# EAGLE design ATM90E36_Breakout (EAGLE 7.4.0)
CNAME: ATM90E36_3P4W; CREVISION: 1.0; DESIGNER: Tisham Dhar
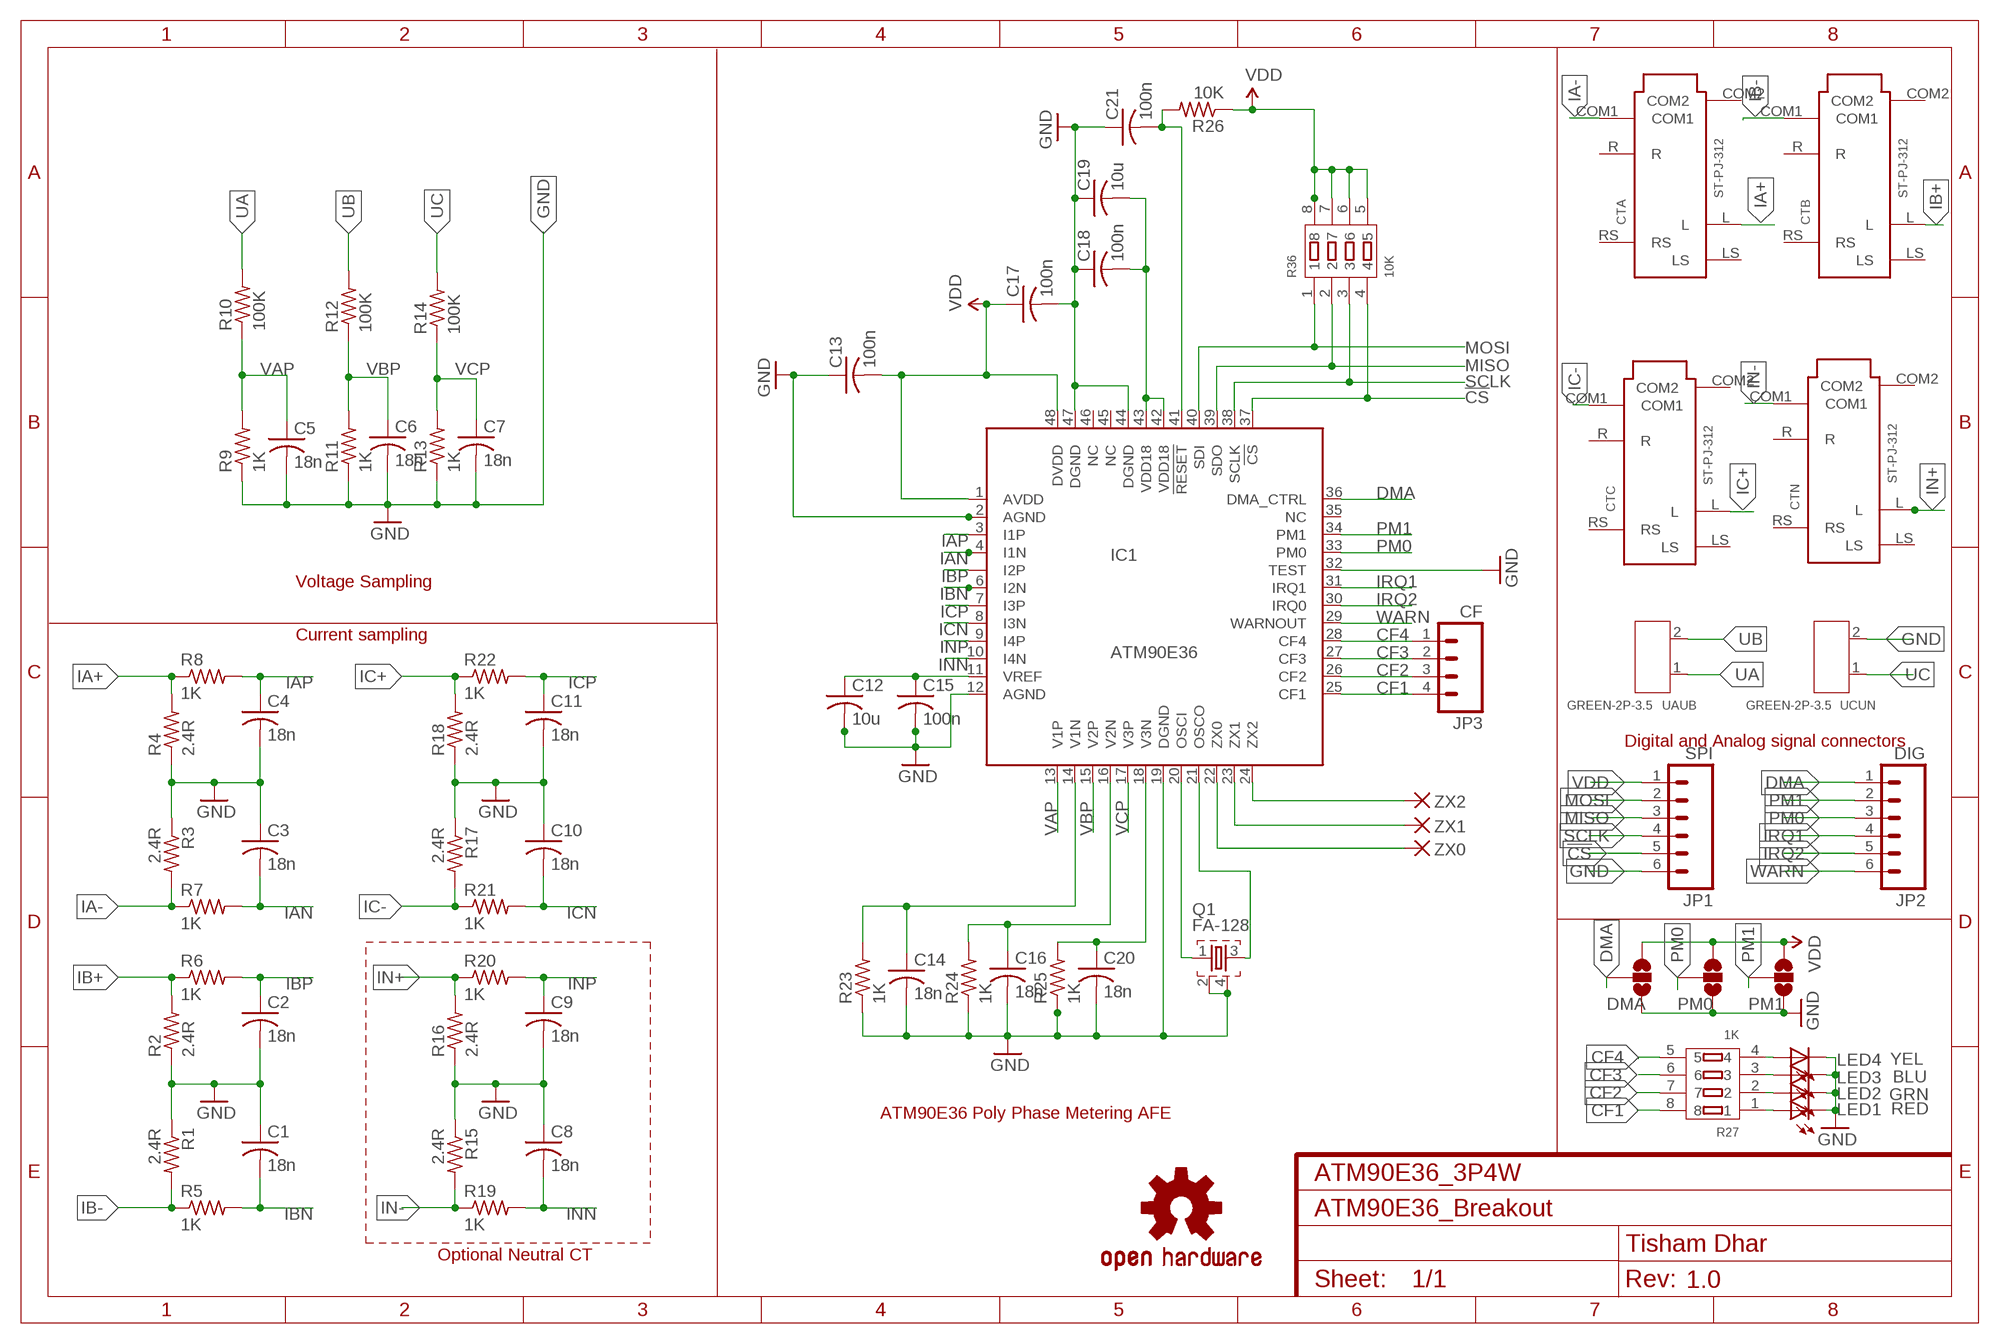
[diagram p0: schematic, sheet 1]

## Parts
C1  18n  C-USC0603  [C0603]
C2  18n  C-USC0603  [C0603]
C3  18n  C-USC0603  [C0603]
C4  18n  C-USC0603  [C0603]
C5  18n  C-USC0603  [C0603]
C6  18n  C-USC0603  [C0603]
C7  18n  C-USC0603  [C0603]
C8  18n  C-USC0603  [C0603]
C9  18n  C-USC0603  [C0603]
C10  18n  C-USC0603  [C0603]
C11  18n  C-USC0603  [C0603]
C12  10u  C-USC0805  [C0805]
C13  100n  C-USC0603  [C0603]
C14  18n  C-USC0603  [C0603]
C15  100n  C-USC0603  [C0603]
C16  18n  C-USC0603  [C0603]
C17  100n  C-USC0603  [C0603]
C18  100n  C-USC0603  [C0603]
C19  10u  C-USC0805  [C0805]
C20  18n  C-USC0603  [C0603]
C21  100n  C-USC0603  [C0603]
CTA  ST-PJ-312  AUDIO-JACK-6P-SMD(ST-PJ-312)  [AUDIO6P-SMD-3.5-14.0X6.4X5.0MM]
CTB  ST-PJ-312  AUDIO-JACK-6P-SMD(ST-PJ-312)  [AUDIO6P-SMD-3.5-14.0X6.4X5.0MM]
CTC  ST-PJ-312  AUDIO-JACK-6P-SMD(ST-PJ-312)  [AUDIO6P-SMD-3.5-14.0X6.4X5.0MM]
CTN  ST-PJ-312  AUDIO-JACK-6P-SMD(ST-PJ-312)  [AUDIO6P-SMD-3.5-14.0X6.4X5.0MM]
DMA  JUMPER-PAD-3-NOFULL_BOX_SILK  [PAD-JUMPER-3-NO_YES_SILK_FULL_BOX]
IC1  ATM90E36  [TQFP48]
JP1  SPI  M06LOCK  [1X06_LOCK]
JP2  DIG  M06LOCK  [1X06_LOCK]
JP3  CF  M04LOCK  [1X04_LOCK]
LED1  RED  LEDCHIP-LED0603  [CHIP-LED0603]
LED2  GRN  LEDCHIP-LED0603  [CHIP-LED0603]
LED3  BLU  LEDCHIP-LED0603  [CHIP-LED0603]
LED4  YEL  LEDCHIP-LED0603  [CHIP-LED0603]
LOGO1  OSHW-LOGOM  [OSHW-LOGO-M]
PM0  JUMPER-PAD-3-NOFULL_BOX_SILK  [PAD-JUMPER-3-NO_YES_SILK_FULL_BOX]
PM1  JUMPER-PAD-3-NOFULL_BOX_SILK  [PAD-JUMPER-3-NO_YES_SILK_FULL_BOX]
Q1  FA-128  [FA-128]
R1  2.4R  R-US_R0603  [R0603]
R2  2.4R  R-US_R0603  [R0603]
R3  2.4R  R-US_R0603  [R0603]
R4  2.4R  R-US_R0603  [R0603]
R5  1K  R-US_R0603  [R0603]
R6  1K  R-US_R0603  [R0603]
R7  1K  R-US_R0603  [R0603]
R8  1K  R-US_R0603  [R0603]
R9  1K  R-US_R0603  [R0603]
R10  100K  R-US_R0603  [R0603]
R11  1K  R-US_R0603  [R0603]
R12  100K  R-US_R0603  [R0603]
R13  1K  R-US_R0603  [R0603]
R14  100K  R-US_R0603  [R0603]
R15  2.4R  R-US_R0603  [R0603]
R16  2.4R  R-US_R0603  [R0603]
R17  2.4R  R-US_R0603  [R0603]
R18  2.4R  R-US_R0603  [R0603]
R19  1K  R-US_R0603  [R0603]
R20  1K  R-US_R0603  [R0603]
R21  1K  R-US_R0603  [R0603]
R22  1K  R-US_R0603  [R0603]
R23  1K  R-US_R0603  [R0603]
R24  1K  R-US_R0603  [R0603]
R25  1K  R-US_R0603  [R0603]
R26  10K  R-US_R0603  [R0603]
R27  1K  SMD-RES-ARRAY-1K-4R(RA1206-8)  [RA1206-8]
R36  10K  SMD-RES-ARRAY-1K-4R(RA1206-8)  [RA1206-8]
UAUB  GREEN-2P-3.5  SCREW-TERMINAL-GREEN(2P-3.5)  [H2-3.5-7.0X7.0MM]
UCUN  GREEN-2P-3.5  SCREW-TERMINAL-GREEN(2P-3.5)  [H2-3.5-7.0X7.0MM]
ZX0  ZX0  SMD2  [SMD1,27-2,54]
ZX1  ZX1  SMD2  [SMD1,27-2,54]
ZX2  ZX0  SMD2  [SMD1,27-2,54]

## Nets
!CS: IC1.37(!CS) JP1.5 R36.4
CF1: IC1.25(CF1) JP3.4 R27.8
CF2: IC1.26(CF2) JP3.3 R27.7
CF3: IC1.27(CF3) JP3.2 R27.6
CF4: IC1.28(CF4) JP3.1 R27.5
DMA: DMA.2 IC1.36(DMA_CTRL) JP2.1
GND [pwr]: C1.1 C2.2 C3.1 C4.2 C5.2 C6.2 C7.2 C8.1 C9.2 C10.1 C11.2 C12.2 C13.1 C14.2 C15.2 C16.2 C17.2 C18.1 C19.1 C20.2 C21.1 DMA.3 IC1.2(AGND) IC1.12(AGND) IC1.19(DGND) IC1.32(TEST) IC1.44(DGND) IC1.47(DGND) JP1.6 LED1.C LED2.C LED3.C LED4.C PM0.3 PM1.3 Q1.2 Q1.4 R1.1 R2.1 R3.1 R4.1 R9.1 R11.1 R13.1 R15.1 R16.1 R17.1 R18.1 R23.1 R24.1 R25.1 UCUN.2
IA+ [analog]: CTA.L R4.2 R8.1
IA- [analog]: CTA.COM1 R3.2 R7.1
IAN [analog]: C3.2 IC1.4(I1N) R7.2
IAP [analog]: C4.1 IC1.3(I1P) R8.2
IB+ [analog]: CTB.L R2.2 R6.1
IB- [analog]: CTB.COM1 R1.2 R5.1
IBN [analog]: C1.2 IC1.6(I2N) R5.2
IBP [analog]: C2.1 IC1.5(I2P) R6.2
IC+ [analog]: CTC.L R18.2 R22.1
IC- [analog]: CTC.COM1 R17.2 R21.1
ICN [analog]: C10.2 IC1.8(I3N) R21.2
ICP [analog]: C11.1 IC1.7(I3P) R22.2
IN+ [analog]: CTN.L R16.2 R20.1
IN- [analog]: CTN.COM1 R15.2 R19.1
INN [analog]: C8.2 IC1.10(I4N) R19.2
INP [analog]: C9.1 IC1.9(I4P) R20.2
IRQ1: IC1.31(IRQ1) JP2.4
IRQ2: IC1.30(IRQ0) JP2.5
MISO: IC1.39(SDO) JP1.3 R36.2
MOSI: IC1.40(SDI) JP1.2 R36.1
N$1: C21.2 IC1.41(!RESET) R26.2
N$3: LED4.A R27.4
N$4: LED3.A R27.3
N$5: LED2.A R27.2
N$6: LED1.A R27.1
N$27 [analog]: C14.1 IC1.14(V1N) R23.2
N$28: IC1.20(OSCI) Q1.1
N$29 [analog]: C16.1 IC1.16(V2N) R24.2
N$30 [analog]: C20.1 IC1.18(V3N) R25.2
N$31: IC1.21(OSCO) Q1.3
N$40 [pwr]: C18.2 C19.2 IC1.42(VDD18) IC1.43(VDD18)
N$55: C12.1 C15.1 IC1.11(VREF)
PM0: IC1.33(PM0) JP2.3 PM0.2
PM1: IC1.34(PM1) JP2.2 PM1.2
SCLK: IC1.38(SCLK) JP1.4 R36.3
UA [analog]: R10.2 UAUB.1
UB [analog]: R12.2 UAUB.2
UC [analog]: R14.2 UCUN.1
VAP [analog]: C5.1 IC1.13(V1P) R9.2 R10.1
VBP [analog]: C6.1 IC1.15(V2P) R11.2 R12.1
VCP [analog]: C7.1 IC1.17(V3P) R13.2 R14.1
VDD [pwr]: C13.2 C17.1 DMA.1 IC1.1(AVDD) IC1.48(DVDD) JP1.1 PM0.1 PM1.1 R26.1 R36.5 R36.6 R36.7 R36.8
WARN: IC1.29(WARNOUT) JP2.6
ZX0: IC1.22(ZX0) ZX0.1(P)
ZX1: IC1.23(ZX1) ZX1.1(P)
ZX2: IC1.24(ZX2) ZX2.1(P)
Unconnected: CTA.COM2 CTA.LS CTA.R CTA.RS CTB.COM2 CTB.LS CTB.R CTB.RS CTC.COM2 CTC.LS CTC.R CTC.RS CTN.COM2 CTN.LS CTN.R CTN.RS IC1.35(NC) IC1.45(NC) IC1.46(NC)

## Notes on the sheet
- Voltage Sampling
- Current sampling
- Digital and Analog signal connectors
- ATM90E36 Poly Phase Metering AFE
- Optional Neutral CT

## Library data of the parts
C1-C21 = adafruit:C-US: CAPACITOR, American symbol
CTA CTB CTC CTN = Seeed-Connector -2016:AUDIO-JACK-6P-SMD(ST-PJ-312): 320040007; MPN: ST-PJ-312
DMA PM0 PM1 = SparkFun-Passives:JUMPER-PAD-3-NO
IC1 = ATM90E36:ATM90E36: ATMEL Poly-phase energy metering; OC_FARNELL: unknown; OC_NEWARK: unknown
JP1 JP2 = SparkFun-Connectors:M06: Header 6 Standard 6-pin 0.1" header. Use with straight break away headers (SKU : PRT-00116), right angle break away headers (PRT-00553), swiss pins (PRT-00743), machine pins (PRT-00117), and female headers (PRT-00115). Molex polarized connector foot print use with SKU : PRT-08094 with associated crimp pins and housings. NOTES ON THE VARIANTS LOCK and LOCK_LONGPADS... This footprint was designed to help hold the alignment of a through-hole component (i.e. 6-pin header) while soldering it into place. You may notice that each hole has been shifted either up or down by 0.005 of an inch from it's more standard position (which is a perfectly straight line). This slight alteration caused the pins (the squares in the middle) to touch the edges of the holes. Because they are alternating, it causes a "brace" to hold the component in place. 0.005 has proven to be the perfect amount of "off-center" position when using our standard breakaway headers. Although looks a little odd when you look at the bare footprint, once you have a header in there, the alteration is very hard to notice. Also,if you push a header all the way into place, it is covered up entirely on the bottom side. This idea of altering the position of holes to aid alignment will be further integrated into the Sparkfun Library for other footprints. It can help hold any component with 3 or more connection pins.
JP3 = SparkFun-Connectors:M04: Header 4 Standard 4-pin 0.1" header. Use with straight break away headers (SKU : PRT-00116), right angle break away headers (PRT-00553), swiss pins (PRT-00743), machine pins (PRT-00117), and female headers (PRT-00115). Molex polarized connector foot print use with SKU : PRT-08231 with associated crimp pins and housings. 1MM SMD Version SKU: PRT-10208
LED1-LED4 = adafruit:LED: LED OSRAM: - CHIPLED LG R971, LG N971, LY N971, LG Q971, LY Q971, LO R971, LY R971 LH N974, LH R974 LS Q976, LO Q976, LY Q976 LO Q996 - Hyper CHIPLED LW Q18S LB Q993, LB Q99A, LB R99A - SideLED LS A670, LO A670, LY A670, LG A670, LP A670 LB A673, LV A673, LT A673, LW A673 LH A674 LY A675 LS A676, LA A676, LO A676, LY A676, LW A676 LS A679, LY A679, LG A679 - Hyper Micro SIDELED® LS Y876, LA Y876, LO Y876, LY Y876 LT Y87S - SmartLED LW L88C, LW L88S LB L89C, LB L89S, LG L890 LS L89K, LO L89K, LY L89K LS L896, LA L896, LO L896, LY L896 - TOPLED LS T670, LO T670, LY T670, LG T670, LP T670 LSG T670, LSP T670, LSY T670, LOP T670, LYG T670 LG T671, LOG T671, LSG T671 LB T673, LV T673, LT T673, LW T673 LH T674 LS T676, LA T676, LO T676, LY T676, LB T676, LH T676, LSB T676, LW T676 LB T67C, LV T67C, LT T67C, LS T67K, LO T67K, LY T67K, LW E67C LS E67B, LA E67B, LO E67B, LY E67B, LB E67C, LV E67C, LT E67C LW T67C LS T679, LY T679, LG T679 LS T770, LO T770, LY T770, LG T770, LP T770 LB T773, LV T773, LT T773, LW T773 LH T774 LS E675, LA E675, LY E675, LS T675 LS T776, LA T776, LO T776, LY T776, LB T776 LHGB T686 LT T68C, LB T68C - Hyper Mini TOPLED® LB M676 - Mini TOPLED Santana® LG M470 LS M47K, LO M47K, LY M47K Source: http://www.osram.convergy.de/
LOGO1 = SparkFun-Aesthetics:OSHW-LOGO: Open Source Hardware Logo This logo indicates the piece of hardware it is found on incorporates a OSHW license and/or adheres to the definition of open source hardware found here: http://freedomdefined.org/OSHW
Q1 = crystal:FA-: MHz RANGE CRYSTAL UNIT Source: Epson Toyocom
R1-R26 = adafruit:R-US_: RESISTOR, American symbol
R27 = Seeed-Resistor-2016:SMD-RES-ARRAY-1K-4R(RA1206-8): 301030012; MPN: Chip-Array-Series-1%
R36 = Seeed-Resistor-2016:SMD-RES-ARRAY-1K-4R(RA1206-8): 301030012; MPN: Chip-Array-Series-1%; VALUE: 1K
UAUB UCUN = Seeed-Connector -2016:SCREW-TERMINAL-GREEN(2P-3.5): 320110028
ZX0 ZX1 ZX2 = wirepad:SMD2: SMD PAD

## Net classes
0 default: width 0.152 mm, drill 0.33 mm, clearance 0.152 mm
1 pwr: width 0.305 mm, drill 0.356 mm, clearance 0.152 mm
2 analog: width 0.305 mm, drill 0.33 mm, clearance 0.152 mm

## Board
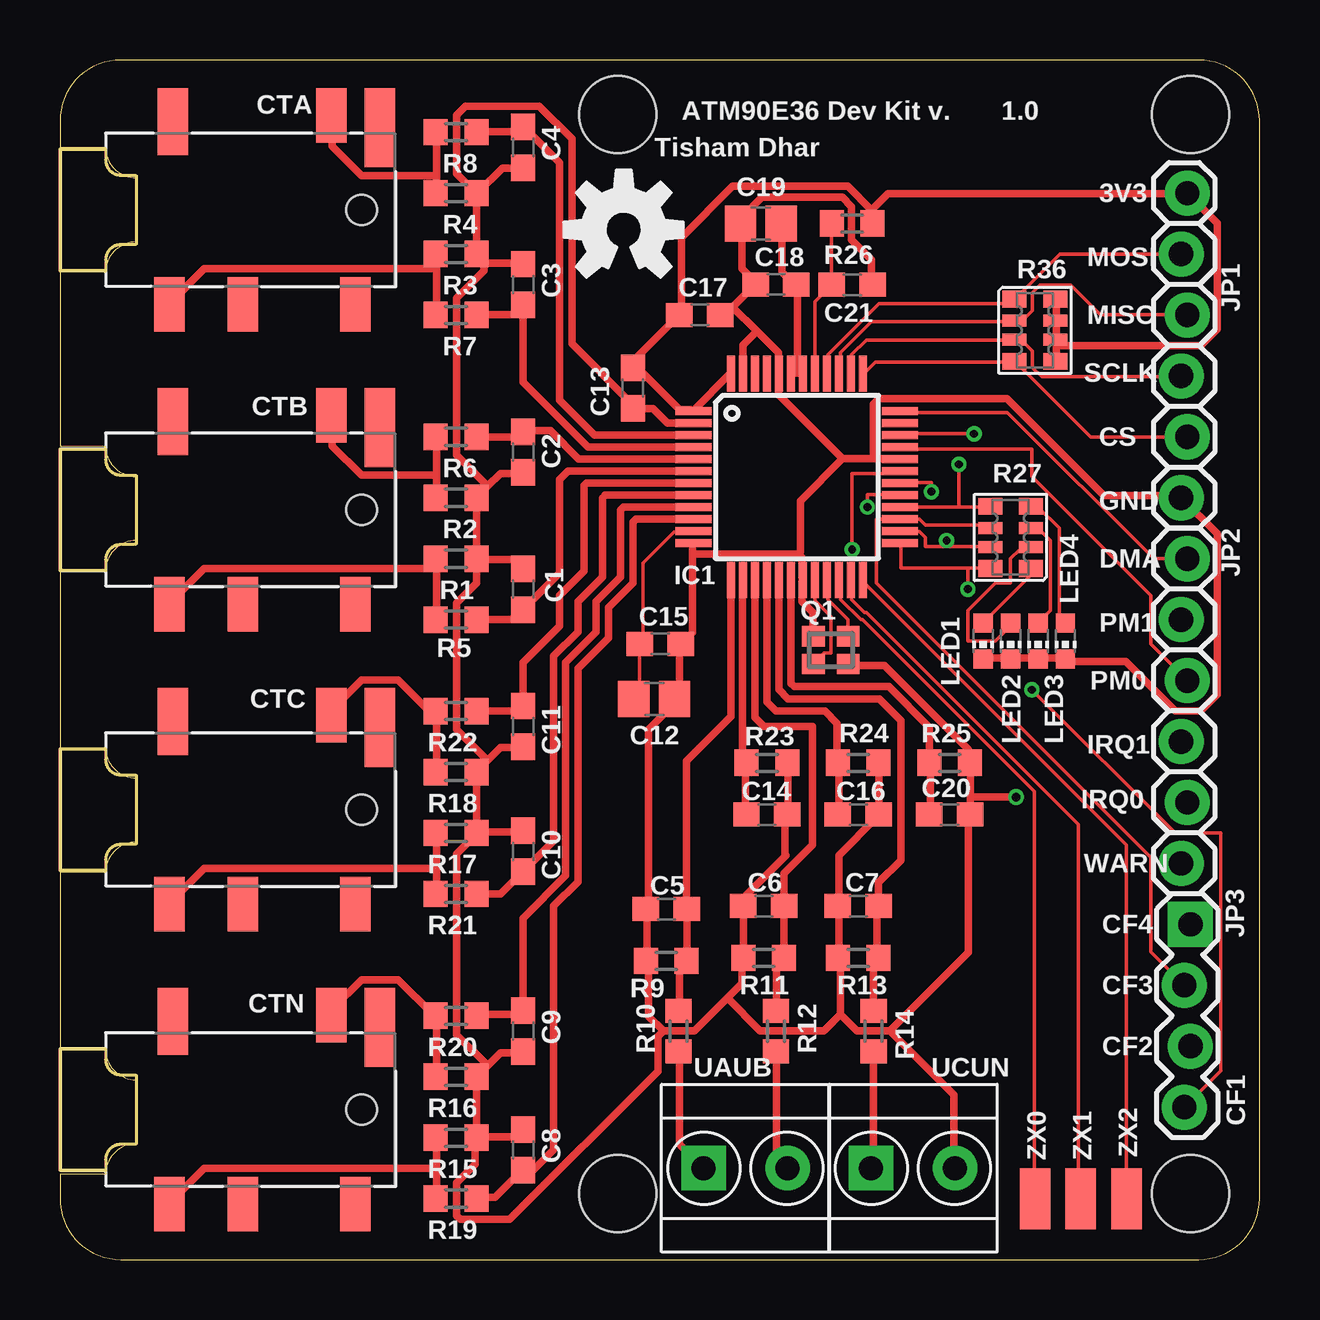
[diagram p1: board, top side]
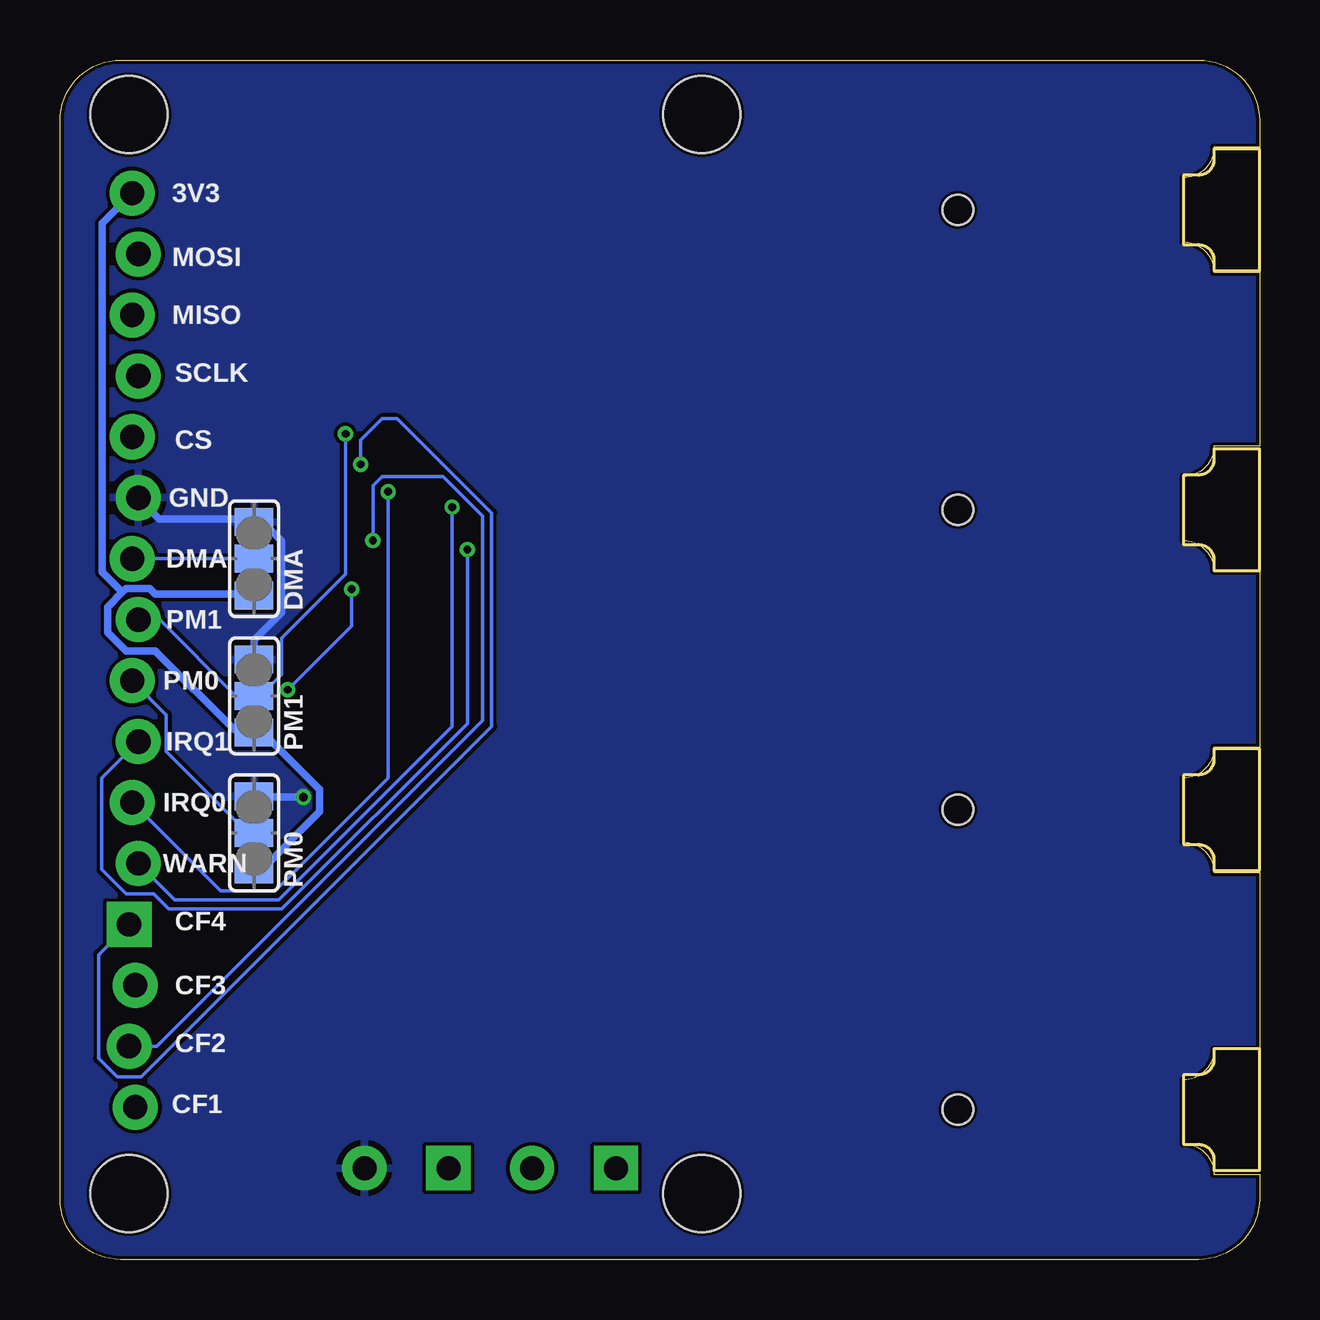
[diagram p2: board, bottom side, seen from below]

Size 50 x 50 mm. Coordinates in mm from the lower left corner, seen from the top.
Outline: 0,47.46 0,46.35 1.91,46.35 arc90 3.17,45.09 3.17,42.42 arc90 1.91,41.15 0,41.15 0,33.91 1.91,33.91 arc90 3.17,32.64 3.17,29.97 arc90 1.91,28.7 0,28.7 0,21.34 1.91,21.34 arc90 3.17,20.07 3.17,17.4 arc90 1.91,16.13 0,16.13 0,8.76 1.91,8.76 arc90 3.17,7.49 3.17,4.83 arc90 1.91,3.56 0,3.56 0,2.54 arc90 2.54,0 47.46,0 arc90 50,2.54 50,47.46 arc90 47.46,50 2.54,50 arc90 0,47.46
Copper layers (1*16): Top 0.035mm / dielectric 1.5mm / Bottom 0.035mm
Design rules "hackvana": minimum track width 6mil, minimum drill 0.3mm, track to track 6mil, track to pad 6mil, pad to pad 6mil, via to via 6mil, smd to smd 0mil, copper to edge 6mil, drill to drill 6mil, minimum pad ring 10mil, minimum via ring 6mil, stop-mask expansion 2mil, vias tented up to drill 100mil, thermal gap 10mil
Holes 3.2 mm at 23.25,47.73 47.12,47.73 47.12,2.75 23.25,2.75

### Footprints (pad centres in the part's own frame; a part is rotated, then mirrored left to right if it is on the bottom)
C0603 = smd 1.1 x 1: 1 -0.85,0; 2 0.85,0
C0805 = smd 1.3 x 1.5: 1 -0.85,0; 2 0.85,0
AUDIO6P-SMD-3.5-14.0X6.4X5.0MM = smd 1.27 x 2.286: COM1 -4.572,3.937; L -11.303,-3.937; R -7.62,3.937; RS -12.319,3.937 | smd 1.27 x 2.794: COM2 -4.699,-3.683 | smd 1.27 x 3.302: LS -13.335,-3.429 | hole 1.27: -12.573,0
PAD-JUMPER-3-NO_YES_SILK_FULL_BOX = smd 1.168 x 1.6: 1 -1.524,0; 2 0,0; 3 1.524,0
TQFP48 = smd 1.499 x 0.33: 1 -4.3,2.75; 2 -4.3,2.25; 3 -4.3,1.75; 4 -4.3,1.25; 5 -4.3,0.75; 6 -4.3,0.25; 7 -4.3,-0.25; 8 -4.3,-0.75; 9 -4.3,-1.25; 10 -4.3,-1.75; 11 -4.3,-2.25; 12 -4.3,-2.75; 25 4.3,-2.75; 26 4.3,-2.25; 27 4.3,-1.75; 28 4.3,-1.25; 29 4.3,-0.75; 30 4.3,-0.25; 31 4.3,0.25; 32 4.3,0.75; 33 4.3,1.25; 34 4.3,1.75; 35 4.3,2.25; 36 4.3,2.75 | smd 0.33 x 1.499: 13 -2.75,-4.3; 14 -2.25,-4.3; 15 -1.75,-4.3; 16 -1.25,-4.3; 17 -0.75,-4.3; 18 -0.25,-4.3; 19 0.25,-4.3; 20 0.75,-4.3; 21 1.25,-4.3; 22 1.75,-4.3; 23 2.25,-4.3; 24 2.75,-4.3; 37 2.75,4.3; 38 2.25,4.3; 39 1.75,4.3; 40 1.25,4.3; 41 0.75,4.3; 42 0.25,4.3; 43 -0.25,4.3; 44 -0.75,4.3; 45 -1.25,4.3; 46 -1.75,4.3; 47 -2.25,4.3; 48 -2.75,4.3
1X06_LOCK = drill 1.016 pad 1.88: 1 0,0; 2 2.54,-0.254; 3 5.08,0; 4 7.62,-0.254; 5 10.16,0; 6 12.7,-0.254
1X04_LOCK = drill 1.016 pad 1.88 square: 1 0,0.127 | drill 1.016 pad 1.88: 2 2.54,-0.127; 3 5.08,0.127; 4 7.62,-0.127
CHIP-LED0603 = smd 0.8 x 0.8: A 0,-0.75; C 0,0.75
FA-128 = smd 0.95 x 0.85: 1 -0.725,-0.575; 2 0.725,-0.575; 3 0.725,0.575; 4 -0.725,0.575
R0603 = smd 1 x 1.1: 1 -0.85,0; 2 0.85,0
RA1206-8 = smd 0.7 x 1: 1 -1.3,-0.85; 4 1.3,-0.85; 5 1.3,0.85; 8 -1.3,0.85 | smd 0.5 x 1: 2 -0.4,-0.85; 3 0.4,-0.85; 6 0.4,0.85; 7 -0.4,0.85
H2-3.5-7.0X7.0MM = drill 1 pad 1.85 square: 1 -1.75,0 | drill 1 pad 1.85: 2 1.75,0
SMD1,27-2,54 = smd 1.27 x 2.54: 1 0,0

### Placement (x,y rotation side)
C1  19.3,27.94 270 top
C2  19.3,33.66 270 top
C3  19.3,40.64 270 top
C4  19.3,46.35 270 top
C5  25.27,14.61 180 top
C6  29.34,14.73 180 top
C7  33.27,14.73 180 top
C8  19.3,4.57 270 top
C9  19.3,9.53 270 top
C10  19.3,17.02 270 top
C11  19.3,22.23 270 top
C12  24.77,23.37 0 top
C13  23.88,36.32 90 top
C14  29.46,18.54 0 top
C15  25.02,25.65 0 top
C16  33.27,18.54 0 top
C17  26.67,39.37 0 top
C18  29.84,40.64 0 top
C19  29.21,43.18 0 top
C20  37.08,18.54 0 top
C21  33.02,40.64 180 top
CTA  0,43.75 180 top
CTB  0,31.25 180 top
CTC  0,18.75 180 top
CTN  0,6.25 180 top
DMA  41.91,29.21 90 bottom
IC1  30.71,32.62 0 top
JP1  46.99,44.45 270 top
JP2  46.99,29.21 270 top
JP3  46.99,13.97 270 top
LED1  38.48,25.78 180 top
LED2  39.62,25.78 180 top
LED3  40.77,25.78 180 top
LED4  41.91,25.78 180 top
LOGO1  23.5,42.93 0 top
PM0  41.91,17.78 90 bottom
PM1  41.91,23.5 90 bottom
Q1  32.13,25.4 0 top
R1  16.51,29.21 180 top
R2  16.51,31.75 180 top
R3  16.51,41.91 180 top
R4  16.51,44.45 180 top
R5  16.51,26.67 0 top
R6  16.51,34.29 0 top
R7  16.51,39.37 0 top
R8  16.51,46.99 0 top
R9  25.27,12.45 0 top
R10  25.78,9.53 270 top
R11  29.34,12.57 0 top
R12  29.84,9.53 270 top
R13  33.27,12.57 0 top
R14  33.91,9.53 270 top
R15  16.51,5.08 180 top
R16  16.51,7.62 180 top
R17  16.51,17.78 180 top
R18  16.51,20.32 180 top
R19  16.51,2.54 0 top
R20  16.51,10.16 0 top
R21  16.51,15.24 0 top
R22  16.51,22.86 0 top
R23  29.46,20.7 180 top
R24  33.27,20.7 180 top
R25  37.08,20.7 180 top
R26  33.02,43.18 180 top
R27  39.62,30.1 90 top
R36  40.64,38.73 270 top
UAUB  28.57,3.81 0 top
UCUN  35.56,3.81 0 top
ZX0  40.64,2.54 180 top
ZX1  42.55,2.54 180 top
ZX2  44.45,2.54 180 top

### Tracks (layer width: path | path; a pad name or v marks a point on that pad's centre or on a via)
!CS
  Top 0.152: IC1.37 33.53,36.96 33.98,37.41 39.78,37.41 R36.4 39.85,37.41 42.98,34.29 JP1.5
CF1  (via drill 0.33)
  Top 0.152: 37.85,28.83 35.05,28.83 35.05,29.84 IC1.25 | 37.85,28.83 38.73,28.83 R27.8 | v37.85,27.94 37.85,28.83 | v40.51,23.75 46.48,17.78 48.39,17.78 48.39,7.87 JP3.4
  Bottom 0.152: v37.85,27.94 37.85,26.42 v40.51,23.75
CF2  (via drill 0.33)
  Top 0.152: 36.96,29.72 36.07,29.72 36.07,30.1 35.81,30.35 35.05,30.35 IC1.26 | 36.96,29.72 38.73,29.72 R27.7 | v36.96,29.97 36.96,29.72
  Bottom 0.152: v36.96,29.97 36.96,32.26 36.58,32.64 34.04,32.64 32.38,30.99 32.38,22.48 45.97,8.89 JP3.3
CF3
  Top 0.152: R27.6 38.73,30.61 36.07,30.61 35.81,30.86 35.05,30.86 IC1.27 34.92,30.86 34.04,30.86 34.04,28.19 45.47,16.76 45.47,12.83 JP3.2
CF4  (via drill 0.33)
  Top 0.152: 37.47,31.37 35.05,31.37 IC1.28 | 37.47,31.37 38.73,31.37 R27.5 | v37.47,33.15 37.47,31.37
  Bottom 0.152: v37.47,33.15 37.47,34.16 36.58,35.05 35.94,35.05 32,31.11 32,22.23 46.61,7.62 47.62,7.62 48.39,8.38 48.39,12.7 JP3.1
DMA
  Top 0.152: JP2.1 45.59,29.21 39.5,35.31 35.05,35.31 IC1.36
  Bottom 0.152: JP2.1 DMA.2
GND  (via drill 0.36)
  Top 0.305: C3.1 19.28,41.53 17.75,41.53 17.37,41.91 R3.1 | R4.1 17.3,44.5 16.54,45.26 16.54,47.7 16.92,48.08 19.96,48.08 21.34,46.71 21.34,38.18 23.85,35.66 23.85,35.51 C13.1 24.73,35.47 25.33,34.87 IC1.2 | C4.2 19.28,45.49 18.44,45.49 17.45,44.5 R4.1 | R3.1 17.37,41.99 17.37,44.35 R4.1 | R1.1 17.37,29.18 18.9,29.18 19.28,28.8 C1.1 | R1.1 17.37,29.34 17.37,31.7 R2.1 17.45,31.85 17.83,32.23 | 17.83,32.23 18.36,32.77 19.28,32.77 C2.2 | R15.1 17.37,5.11 18.97,5.11 19.28,5.41 C8.1 | R16.1 17.37,7.62 17.37,5.26 R15.1 | C9.2 19.28,8.61 18.36,8.61 17.45,7.7 R16.1 | R17.1 17.37,17.83 19.28,17.83 C10.1 | R17.1 17.37,17.98 17.37,20.27 R18.1 17.45,20.42 17.83,20.8 | 17.83,20.8 18.36,21.34 19.28,21.34 C11.2 | R16.1 17.75,8.15 16.54,9.37 16.54,16.92 17.3,17.68 R17.1 | 17.83,20.8 16.54,22.1 16.54,27.36 17.37,28.19 17.37,29.03 R1.1 | 17.83,32.23 16.54,33.53 16.54,40.08 17.68,41.22 17.68,41.45 R3.1 | 25.15,9.53 24.54,10.13 24.54,12.34 R9.1 24.46,12.5 24.46,14.55 C5.2 24.54,14.71 24.54,22.1 25.68,23.24 C12.2 25.68,23.39 25.83,23.55 25.83,25.6 C15.2 25.98,25.76 26.36,26.14 26.36,29.41 | 25.15,9.53 26.44,9.53 27.81,10.9 | 27.81,10.9 28.42,11.51 28.42,12.5 R11.1 28.5,14.71 C6.2 28.57,14.86 28.57,15.16 30.25,16.84 30.23,16.89 30.23,18.54 C14.2 30.35,18.67 30.35,20.7 R23.1 | Q1.2 32.92,24.77 34.37,24.77 37.87,21.26 37.87,20.73 R25.1 37.95,20.57 37.95,19.28 | 37.95,19.28 37.95,18.59 C20.2 37.87,18.44 37.87,12.8 34.59,9.53 | 37.95,19.28 v39.85,19.28 | R24.1 34.14,20.65 34.14,18.59 C16.2 34.06,18.44 32.46,16.84 32.46,14.86 C7.2 32.46,14.71 32.46,12.57 R13.1 32.54,12.5 32.54,10.21
  Top 0.305: 34.59,9.53 37.26,6.86 37.26,3.81 UCUN.2 | 34.59,9.53 33.22,9.53 32.54,10.21 | 27.81,10.9 29.18,9.53 31.85,9.53 32.54,10.21 | LED1.C 38.48,25.07 39.62,25.07 LED2.C 39.7,25.07 40.77,25.07 LED3.C 40.84,25.07 41.91,25.07 LED4.C 41.99,24.92 44.42,24.92 46.48,22.86 47.55,22.86 48.23,23.55 48.23,30.25 JP1.6 46.63,31.85 43.51,31.85 39.47,35.89 34.14,35.89 33.91,35.66 33.91,33.38 | Q1.4 31.39,25.98 31.39,26.98 30.94,27.43 30.94,28.27 IC1.19 30.94,28.42 30.94,29.26 30.79,29.41 | 26.36,29.41 26.36,29.79 IC1.12 | 26.36,29.41 30.79,29.41 | C21.1 33.83,40.69 33.83,41.68 32.99,42.52 32.99,43.89 32.61,44.27 29.26,44.27 28.42,43.43 28.42,43.2 C19.1 28.42,43.05 28.42,41.3 28.96,40.77 C18.1 28.96,40.62 28.04,39.7 | 28.04,39.7 27.74,39.4 27.58,39.4 C17.2 | 28.04,39.7 29.05,38.7 | 29.05,38.7 29.95,37.8 29.95,36.96 IC1.44 29.95,36.8 29.95,36.04 32.61,33.38 | 32.61,33.38 33.91,33.38 | 33.91,33.38 34.98,33.38 IC1.32 | 32.61,33.38 30.86,31.62 30.86,29.49 30.79,29.41 | 25.15,9.53 24.92,9.3 24.92,7.85 18.75,1.68 16.69,1.68 16.54,1.83 16.54,3.2 17.3,3.96 17.3,4.95 R15.1 | IC1.47 28.46,38.12 29.05,38.7
  Bottom 0.305: v39.85,19.28 41.91,19.28 PM0.3 | PM1.3 41.91,25.83 40.77,26.98 40.77,29.95 41.53,30.71 41.91,30.71 DMA.3 41.99,30.86 45.87,30.86 46.71,31.7 JP1.6
  pour Bottom: 0,50 50,50 50,0 0,0
IA+
  Top 0.305: 15.7,45.19 15.7,46.94 R8.1 | 15.7,45.19 15.7,44.5 R4.2 | 15.7,45.19 12.57,45.19 11.35,46.41 11.35,47.62 CTA.L
IA-
  Top 0.305: 15.7,41.3 15.7,41.91 R3.2 | 15.7,41.3 15.7,39.4 R7.1 | 15.7,41.3 6.02,41.3 4.57,39.85 CTA.COM1
IAN
  Top 0.305: IC1.4 22.01,33.87 19.3,36.58 C3.2 19.2,39.4 17.37,39.4 R7.2
IAP
  Top 0.305: IC1.3 22.27,34.37 20.83,35.81 20.83,45.72 19.34,47.2 C4.1 19.2,47.09 19.13,47.02 17.37,47.02 R8.2
IB+
  Top 0.305: 15.7,32.69 15.7,34.29 R6.1 | 15.7,32.69 15.7,31.77 R2.2 | 15.7,32.69 12.57,32.69 11.35,33.91 11.35,35.13 CTB.L
IB-
  Top 0.305: R5.1 15.7,26.67 15.7,29.18 R1.2 15.62,28.8 6.02,28.8 4.57,27.36 CTB.COM1
IBN
  Top 0.305: IC1.6 21.19,32.87 20.83,32.51 20.83,28.61 C1.2 19.2,27.05 18.82,26.67 R5.2
IBP
  Top 0.305: IC1.5 21.62,33.37 20.45,34.54 19.34,34.54 C2.1 19.2,34.44 19.05,34.29 R6.2
IC+
  Top 0.305: R18.2 15.7,20.34 15.7,22.86 R22.1 15.54,22.94 15.32,22.94 14.1,24.16 12.57,24.16 11.35,22.94 11.35,22.71 CTC.L
IC-
  Top 0.305: 15.7,16.31 15.7,17.75 R17.2 | 15.7,16.31 15.7,15.24 R21.1 | 15.7,16.31 6.02,16.31 4.57,14.86 CTC.COM1
ICN
  Top 0.305: IC1.8 22.73,31.87 22.61,31.75 22.61,28.45 21.59,27.43 21.59,26.16 20.57,25.15 20.57,17.44 C10.2 19.2,16.08 18.36,15.24 R21.2
ICP
  Top 0.305: IC1.7 21.96,32.37 21.84,32.26 21.84,28.7 20.83,27.69 20.83,26.42 19.3,24.89 C11.1 19.2,23.01 19.05,22.86 R22.2
IN+
  Top 0.305: R16.2 15.7,7.62 15.7,10.13 R20.1 15.54,10.21 14.1,11.66 12.57,11.66 11.35,10.44 11.35,10.21 CTN.L
IN-
  Top 0.305: 15.7,3.81 15.7,5.03 R15.2 | 15.7,3.81 15.7,2.59 R19.1 | 15.7,3.81 6.02,3.81 4.57,2.36 CTN.COM1
INN
  Top 0.305: IC1.10 24.01,30.87 23.88,30.73 23.88,28.19 22.86,27.18 22.86,25.91 21.59,24.64 21.59,15.75 20.57,14.73 20.57,4.57 19.72,3.72 C8.2 19.2,3.66 18.14,2.59 17.37,2.59 R19.2
INP
  Top 0.305: IC1.9 23.5,31.37 23.37,31.24 23.37,28.45 22.35,27.43 22.35,26.16 21.08,24.89 21.08,16 19.3,14.22 C9.1 19.2,10.29 19.13,10.21 17.37,10.21 R20.2
IRQ1  (via drill 0.33)
  Top 0.152: v33.02,29.59 33.02,32.77 34.92,32.77 IC1.31
  Bottom 0.152: v33.02,29.59 33.02,22.35 40.77,14.61 45.47,14.61 46.1,15.24 47.24,15.24 48.26,16.26 48.26,20.07 JP2.4
IRQ2  (via drill 0.33)
  Top 0.152: v36.32,32 36.32,32.38 35.05,32.38 IC1.30
  Bottom 0.152: v36.32,32 36.32,20.07 41.02,15.37 43.31,15.37 JP2.5
MISO
  Top 0.152: IC1.39 32.54,36.96 32.54,37.8 33.83,39.09 39.78,39.09 R36.2 39.85,39.17 40.16,39.17 40.54,39.55 40.54,40.31 40.84,40.62 42.14,40.62 43.36,39.4 46.94,39.4 JP1.3
MOSI
  Top 0.152: JP1.2 41.68,41.91 39.85,40.08 R36.1 39.78,40.01 39.62,39.85 34.14,39.85 32,37.72 32,36.96 IC1.40
N$1
  Top 0.152: R26.2 32.16,43.13 32.16,40.69 C21.2 32.16,40.62 31.47,39.93 31.47,36.96 IC1.41
N$3
  Top 0.152: LED4.A 41.91,26.54 41.66,26.8 41.66,30.48 40.77,31.37 40.51,31.37 R27.4
N$4
  Top 0.152: LED3.A 40.77,26.54 41.27,27.05 41.27,29.97 40.77,30.48 40.51,30.48 R27.3
N$5
  Top 0.152: LED2.A 39.62,26.42 38.99,25.78 37.85,25.78 37.85,27.05 38.99,28.19 39.62,28.19 39.62,29.21 40.01,29.59 40.39,29.59 R27.2
N$6
  Top 0.152: LED1.A 38.48,26.54 40.39,28.45 40.39,28.7 R27.1
N$27
  Top 0.305: C14.1 28.57,18.54 28.57,20.7 R23.2 28.45,20.7 28.45,28.19 IC1.14
N$28
  Top 0.152: IC1.20 31.46,27.46 32.13,26.8 32.13,25.27 31.85,25.27 Q1.1
N$29
  Top 0.305: IC1.16 29.46,23.24 29.84,22.86 31.88,22.86 32.38,22.35 32.38,20.74 R24.2 32.46,20.57 32.46,18.59 C16.1
N$30
  Top 0.305: IC1.18 30.46,24.02 30.61,23.88 34.54,23.88 36.23,22.19 R25.2 36.27,20.57 36.27,18.59 C20.1
N$31
  Top 0.152: Q1.3 32.84,25.98 32.84,26.67 32,27.51 32,28.27 IC1.21
N$40
  Top 0.305: 30.73,36.96 30.86,36.96 IC1.42 | 30.73,36.96 30.48,36.96 IC1.43 | C19.2 30.1,43.18 30.1,41.15 30.61,40.64 C18.2 30.73,40.51 30.73,36.96
N$55
  Top 0.152: C12.1 23.93,23.39 24.16,23.62 24.16,25.6 C15.1 24.23,25.68 24.31,25.76 24.31,29.03 25.6,30.33 26.36,30.33 IC1.11
PM0
  Top 0.152: JP2.3 45.47,25.65 45.47,27.69 40.51,32.64 40.51,33.78 35.05,33.78 IC1.33
  Bottom 0.152: JP2.3 45.57,22.71 45.57,21.18 42.22,17.83 41.91,17.83 PM0.2
PM1  (via drill 0.33)
  Top 0.152: v38.1,34.42 35.05,34.42 IC1.34
  Bottom 0.152: v38.1,34.42 38.1,28.57 40.77,25.91 40.77,24.38 41.66,23.5 PM1.2 42.67,23.5 45.85,26.67 JP2.2
SCLK
  Top 0.152: IC1.38 32.99,36.96 32.99,37.72 33.6,38.33 39.78,38.33 R36.3 39.85,38.33 40.08,38.33 40.54,37.87 40.54,37.19 40.92,36.8 46.71,36.8 JP1.4
UA
  Top 0.305: R10.2 25.83,8.61 25.83,4.8 UAUB.1
UB
  Top 0.305: R12.2 29.87,8.61 29.87,4.19 30.25,3.81 UAUB.2
UC
  Top 0.305: R14.2 33.91,3.89 33.83,3.81 UCUN.1
VAP
  Top 0.305: IC1.13 27.96,22.63 26.12,20.79 C5.1 26.14,14.48 26.14,12.57 R9.2 26.06,12.42 25.83,12.19 25.83,10.44 R10.1
VBP
  Top 0.305: IC1.15 28.96,22.6 29.34,22.23 31.37,22.23 31.37,17.27 30.19,16.09 C6.1 30.18,14.63 30.18,12.65 R11.2 30.18,12.57 29.87,12.27 29.87,10.44 R12.1
VCP
  Top 0.305: IC1.17 29.96,23.76 30.35,23.37 34.16,23.37 35.05,22.48 35.05,16.64 34.12,15.71 C7.1 34.06,14.63 34.06,12.65 R13.2 34.06,12.57 33.91,12.42 R14.1
VDD
  Top 0.305: R36.5 41.53,37.49 41.53,38.33 R36.6 | R36.6 41.53,38.48 41.53,39.09 R36.7 41.53,39.24 41.53,40.01 R36.8 | R36.6 41.6,38.1 47.55,38.1 48.23,38.79 48.23,43.2 JP1.1 46.86,44.42 34.52,44.42 33.83,43.74 | IC1.48 27.89,36.88 26.44,35.43 IC1.1 26.29,35.43 25.83,35.43 24.08,37.19 C13.2 23.93,37.19 23.93,37.49 25.76,39.32 C17.1 25.91,39.47 25.91,42.6 28.04,44.73 32.84,44.73 33.83,43.74 | 33.83,43.74 33.83,43.2 R26.1
  Bottom 0.305: PM0.1 41.91,16.31 41.53,16.31 39.17,18.67 39.17,19.58 41.53,21.95 41.91,21.95 PM1.1 41.99,22.1 42.75,22.1 46.02,25.38 47.24,25.38 48.01,26.14 48.01,27.2 47.4,27.81 | 47.4,27.81 47.24,27.96 46.25,27.96 46.02,27.74 41.91,27.74 DMA.1 | 47.4,27.81 48.23,28.65 48.23,43.2 JP1.1
WARN  (via drill 0.33)
  Top 0.152: v33.66,31.37 33.66,31.88 34.92,31.88 IC1.29
  Bottom 0.152: v33.66,31.37 33.66,22.23 40.89,14.99 45.21,14.99 JP2.6
ZX0
  Top 0.152: IC1.22 32.54,28.27 32.54,27.51 33.38,26.67 33.45,26.67 40.62,19.51 40.62,2.59 ZX0.1
ZX1
  Top 0.152: IC1.23 32.99,28.27 32.99,27.51 33.53,26.98 33.6,26.98 42.44,18.14 42.44,2.67 42.52,2.59 ZX1.1
ZX2
  Top 0.152: ZX2.1 44.45,17.27 33.53,28.19 IC1.24

### Text on the board
tNames: ATM90E36 Dev Kit v. | 3V3 | MOSI | MISO | SCLK | CS | GND | DMA | PM1 | PM0 | IRQ1 | IRQ0 | WARN | CF4 | CF3 | CF2 | CF1
bNames: 3V3 | MOSI | MISO | SCLK | CS | GND | DMA | PM1 | PM0 | IRQ1 | IRQ0 | WARN | CF4 | CF3 | CF2 | CF1